# Altium project RadioTransceiverBoard.PrjPcb (part 1 of 3)
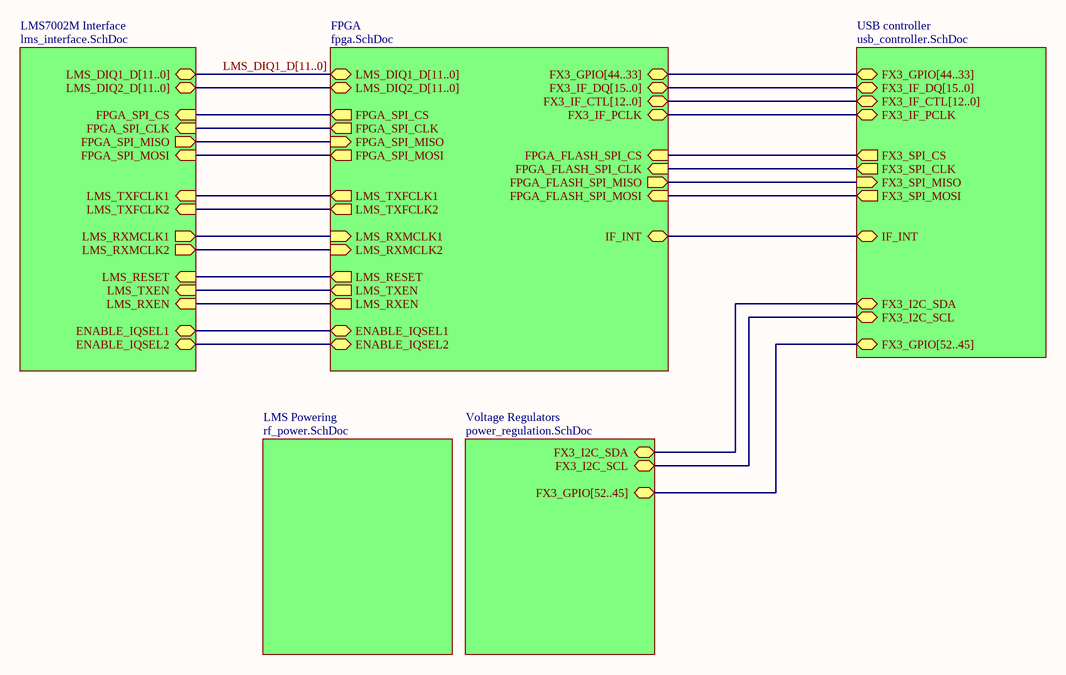
[diagram p0: Radio Transceiver.SchDoc]
17 sheets, 353 parts. Net scope: hierarchical (ports join the sheet entries above them; power ports are global).
Sheets:
  Radio Transceiver.SchDoc
    FPGA = fpga.SchDoc
    LMS7002M Interface = lms_interface.SchDoc
      rf_transmit1 = rf_transmit.SchDoc
      rf_transmit2 = rf_transmit.SchDoc
      rf_receive1 = rf_receive.SchDoc
      rf_receive2 = rf_receive.SchDoc
    USB controller = usb_controller.SchDoc
    Voltage Regulators = power_regulation.SchDoc
    LMS Powering = rf_power.SchDoc
      A_conn_1P25A1 = A_conn_1P25A.SchDoc
      A_conn_1P25A2 = A_conn_1P25A.SchDoc
      A_conn_1P25A3 = A_conn_1P25A.SchDoc
      A_conn_1P25A4 = A_conn_1P25A.SchDoc
      A_conn_1P25A5 = A_conn_1P25A.SchDoc
      A_conn_1P25A6 = A_conn_1P25A.SchDoc
      A_conn_1P25A7 = A_conn_1P25A.SchDoc
      A_conn_1P25A8 = A_conn_1P25A.SchDoc
      A_conn_1P25A9 = A_conn_1P25A.SchDoc
      A_conn_1P25A10 = A_conn_1P25A.SchDoc
      A_conn_1P25A11 = A_conn_1P25A.SchDoc
      A_conn_1P4A1 = A_conn_1P4A.SchDoc
      A_conn_1P4A2 = A_conn_1P4A.SchDoc
      A_conn_1P4A3 = A_conn_1P4A.SchDoc
      A_conn_1P4A4 = A_conn_1P4A.SchDoc
      A_conn_1P4A5 = A_conn_1P4A.SchDoc
      A_conn_1P4A6 = A_conn_1P4A.SchDoc
      B_conn_1P25A1 = B_conn_1P25A.SchDoc
      B_conn_1P25A2 = B_conn_1P25A.SchDoc
      B_conn_1P25A3 = B_conn_1P25A.SchDoc
      A_conn_1P25D1 = A_conn_1P25D.SchDoc
      A_conn_1P25D2 = A_conn_1P25D.SchDoc
      A_conn_1P25D3 = A_conn_1P25D.SchDoc
      A_conn_1P25D4 = A_conn_1P25D.SchDoc
      D_conn_1P25A1 = D_conn_1P25A.SchDoc
      D_conn_1P25A2 = D_conn_1P25A.SchDoc
      A_conn_1P8A1 = A_conn_1P8A.SchDoc
      A_conn_1P8A2 = A_conn_1P8A.SchDoc
      A_conn_1P8A3 = A_conn_1P8A.SchDoc
      A_conn_1P8A4 = A_conn_1P8A.SchDoc
      A_conn_1P8A5 = A_conn_1P8A.SchDoc
      A_conn_1P8A6 = A_conn_1P8A.SchDoc
      A_conn_1P8A7 = A_conn_1P8A.SchDoc
      A_conn_1P8A8 = A_conn_1P8A.SchDoc
      A_conn_1P8A9 = A_conn_1P8A.SchDoc
      A_conn_1P8A10 = A_conn_1P8A.SchDoc
      D_conn_1P8A1 = D_conn_1P8A.SchDoc
      D_conn_1P8A2 = D_conn_1P8A.SchDoc
      C_conn_1P25D1 = C_conn_1P25D.SchDoc
      C_conn_1P25D2 = C_conn_1P25D.SchDoc
      C_conn_1P25D3 = C_conn_1P25D.SchDoc
      C_conn_1P25D4 = C_conn_1P25D.SchDoc
      C_conn_1P8D1 = C_conn_1P8D.SchDoc
      C_conn_1P8D2 = C_conn_1P8D.SchDoc
      C_conn_1P8D3 = C_conn_1P8D.SchDoc
      C_conn_1P8D4 = C_conn_1P8D.SchDoc

## Sheet Radio Transceiver.SchDoc
size A; SheetNumber: 1; SheetTotal: 17

### Sub-sheets
FPGA = fpga.SchDoc: LMS_DIQ1_D[11..0] (bidir), LMS_DIQ2_D[11..0] (bidir), FPGA_FLASH_SPI_CS (in), FPGA_FLASH_SPI_CLK (in), FPGA_FLASH_SPI_MISO (out), FPGA_FLASH_SPI_MOSI (in), FPGA_SPI_CS (out), FPGA_SPI_CLK (out), FPGA_SPI_MISO (in), FPGA_SPI_MOSI (out), LMS_TXFCLK1 (out), LMS_TXFCLK2 (out), LMS_RXMCLK1 (in), LMS_RXMCLK2 (in), FX3_GPIO[44..33] (bidir), FX3_IF_DQ[15..0] (bidir), FX3_IF_CTL[12..0] (bidir), FX3_IF_PCLK (bidir), LMS_RESET (out), LMS_TXEN (out), LMS_RXEN (out), ENABLE_IQSEL1 (bidir), ENABLE_IQSEL2 (bidir), IF_INT (bidir)
LMS7002M Interface = lms_interface.SchDoc: LMS_DIQ1_D[11..0] (bidir), FPGA_SPI_CS (in), FPGA_SPI_CLK (in), FPGA_SPI_MISO (out), FPGA_SPI_MOSI (in), LMS_DIQ2_D[11..0] (bidir), LMS_TXFCLK1 (in), LMS_TXFCLK2 (in), LMS_RXMCLK1 (out), LMS_RXMCLK2 (out), LMS_RESET (in), LMS_TXEN (in), LMS_RXEN (in), ENABLE_IQSEL1 (bidir), ENABLE_IQSEL2 (bidir)
LMS Powering = rf_power.SchDoc: no entries
USB controller = usb_controller.SchDoc: FX3_SPI_CS (out), FX3_SPI_CLK (out), FX3_SPI_MISO (in), FX3_SPI_MOSI (out), FX3_GPIO[44..33] (bidir), FX3_IF_DQ[15..0] (bidir), FX3_IF_CTL[12..0] (bidir), FX3_GPIO[52..45] (bidir), FX3_I2C_SCL (bidir), FX3_I2C_SDA (bidir), FX3_IF_PCLK (bidir), IF_INT (bidir)
Voltage Regulators = power_regulation.SchDoc: FX3_GPIO[52..45] (bidir), FX3_I2C_SCL (bidir), FX3_I2C_SDA (bidir)

### Nets
FPGA_SPI_CLK: sheet FPGA/FPGA_SPI_CLK, sheet LMS7002M Interface/FPGA_SPI_CLK
FPGA_SPI_CS: sheet FPGA/FPGA_SPI_CS, sheet LMS7002M Interface/FPGA_SPI_CS
FPGA_SPI_MISO: sheet FPGA/FPGA_SPI_MISO, sheet LMS7002M Interface/FPGA_SPI_MISO
FPGA_SPI_MOSI: sheet FPGA/FPGA_SPI_MOSI, sheet LMS7002M Interface/FPGA_SPI_MOSI
FX3_I2C_SCL: sheet USB controller/FX3_I2C_SCL, sheet Voltage Regulators/FX3_I2C_SCL
FX3_I2C_SDA: sheet USB controller/FX3_I2C_SDA, sheet Voltage Regulators/FX3_I2C_SDA
FX3_IF_PCLK: sheet FPGA/FX3_IF_PCLK, sheet USB controller/FX3_IF_PCLK
FX3_SPI_CLK: sheet FPGA/FPGA_FLASH_SPI_CLK, sheet USB controller/FX3_SPI_CLK
FX3_SPI_CS: sheet FPGA/FPGA_FLASH_SPI_CS, sheet USB controller/FX3_SPI_CS
FX3_SPI_MISO: sheet FPGA/FPGA_FLASH_SPI_MISO, sheet USB controller/FX3_SPI_MISO
FX3_SPI_MOSI: sheet FPGA/FPGA_FLASH_SPI_MOSI, sheet USB controller/FX3_SPI_MOSI
NetIC200#3_D2: sheet FPGA/LMS_RESET, sheet LMS7002M Interface/LMS_RESET
NetIC200#3_D3: sheet FPGA/LMS_TXEN, sheet LMS7002M Interface/LMS_TXEN
NetIC200#3_D4: sheet FPGA/LMS_RXEN, sheet LMS7002M Interface/LMS_RXEN
NetIC200#3_E1: sheet FPGA/ENABLE_IQSEL1, sheet LMS7002M Interface/ENABLE_IQSEL1
NetIC200#3_E2: sheet FPGA/ENABLE_IQSEL2, sheet LMS7002M Interface/ENABLE_IQSEL2
NetIC200#3_G1: sheet FPGA/LMS_RXMCLK2, sheet LMS7002M Interface/LMS_RXMCLK2
NetIC200#3_G4: sheet FPGA/LMS_TXFCLK2, sheet LMS7002M Interface/LMS_TXFCLK2
NetIC200#3_J2: sheet FPGA/LMS_RXMCLK1, sheet LMS7002M Interface/LMS_RXMCLK1
NetIC200#3_J3: sheet FPGA/LMS_TXFCLK1, sheet LMS7002M Interface/LMS_TXFCLK1
NetIC201_P11: sheet FPGA/IF_INT, sheet USB controller/IF_INT

### Buses and harness runs
bus LMS_DIQ1_D[11..0] = sheet FPGA/LMS_DIQ1_D[11..0] = sheet LMS7002M Interface/LMS_DIQ1_D[11..0]
bus sheet FPGA/FX3_GPIO[44..33] = sheet USB controller/FX3_GPIO[44..33]
bus sheet FPGA/FX3_IF_CTL[12..0] = sheet USB controller/FX3_IF_CTL[12..0]
bus sheet FPGA/FX3_IF_DQ[15..0] = sheet USB controller/FX3_IF_DQ[15..0]
bus sheet FPGA/LMS_DIQ2_D[11..0] = sheet LMS7002M Interface/LMS_DIQ2_D[11..0]
bus sheet USB controller/FX3_GPIO[52..45] = sheet Voltage Regulators/FX3_GPIO[52..45]

## Sheet fpga.SchDoc
size 381 x 241 mm; SheetNumber: 13; SheetTotal: 17
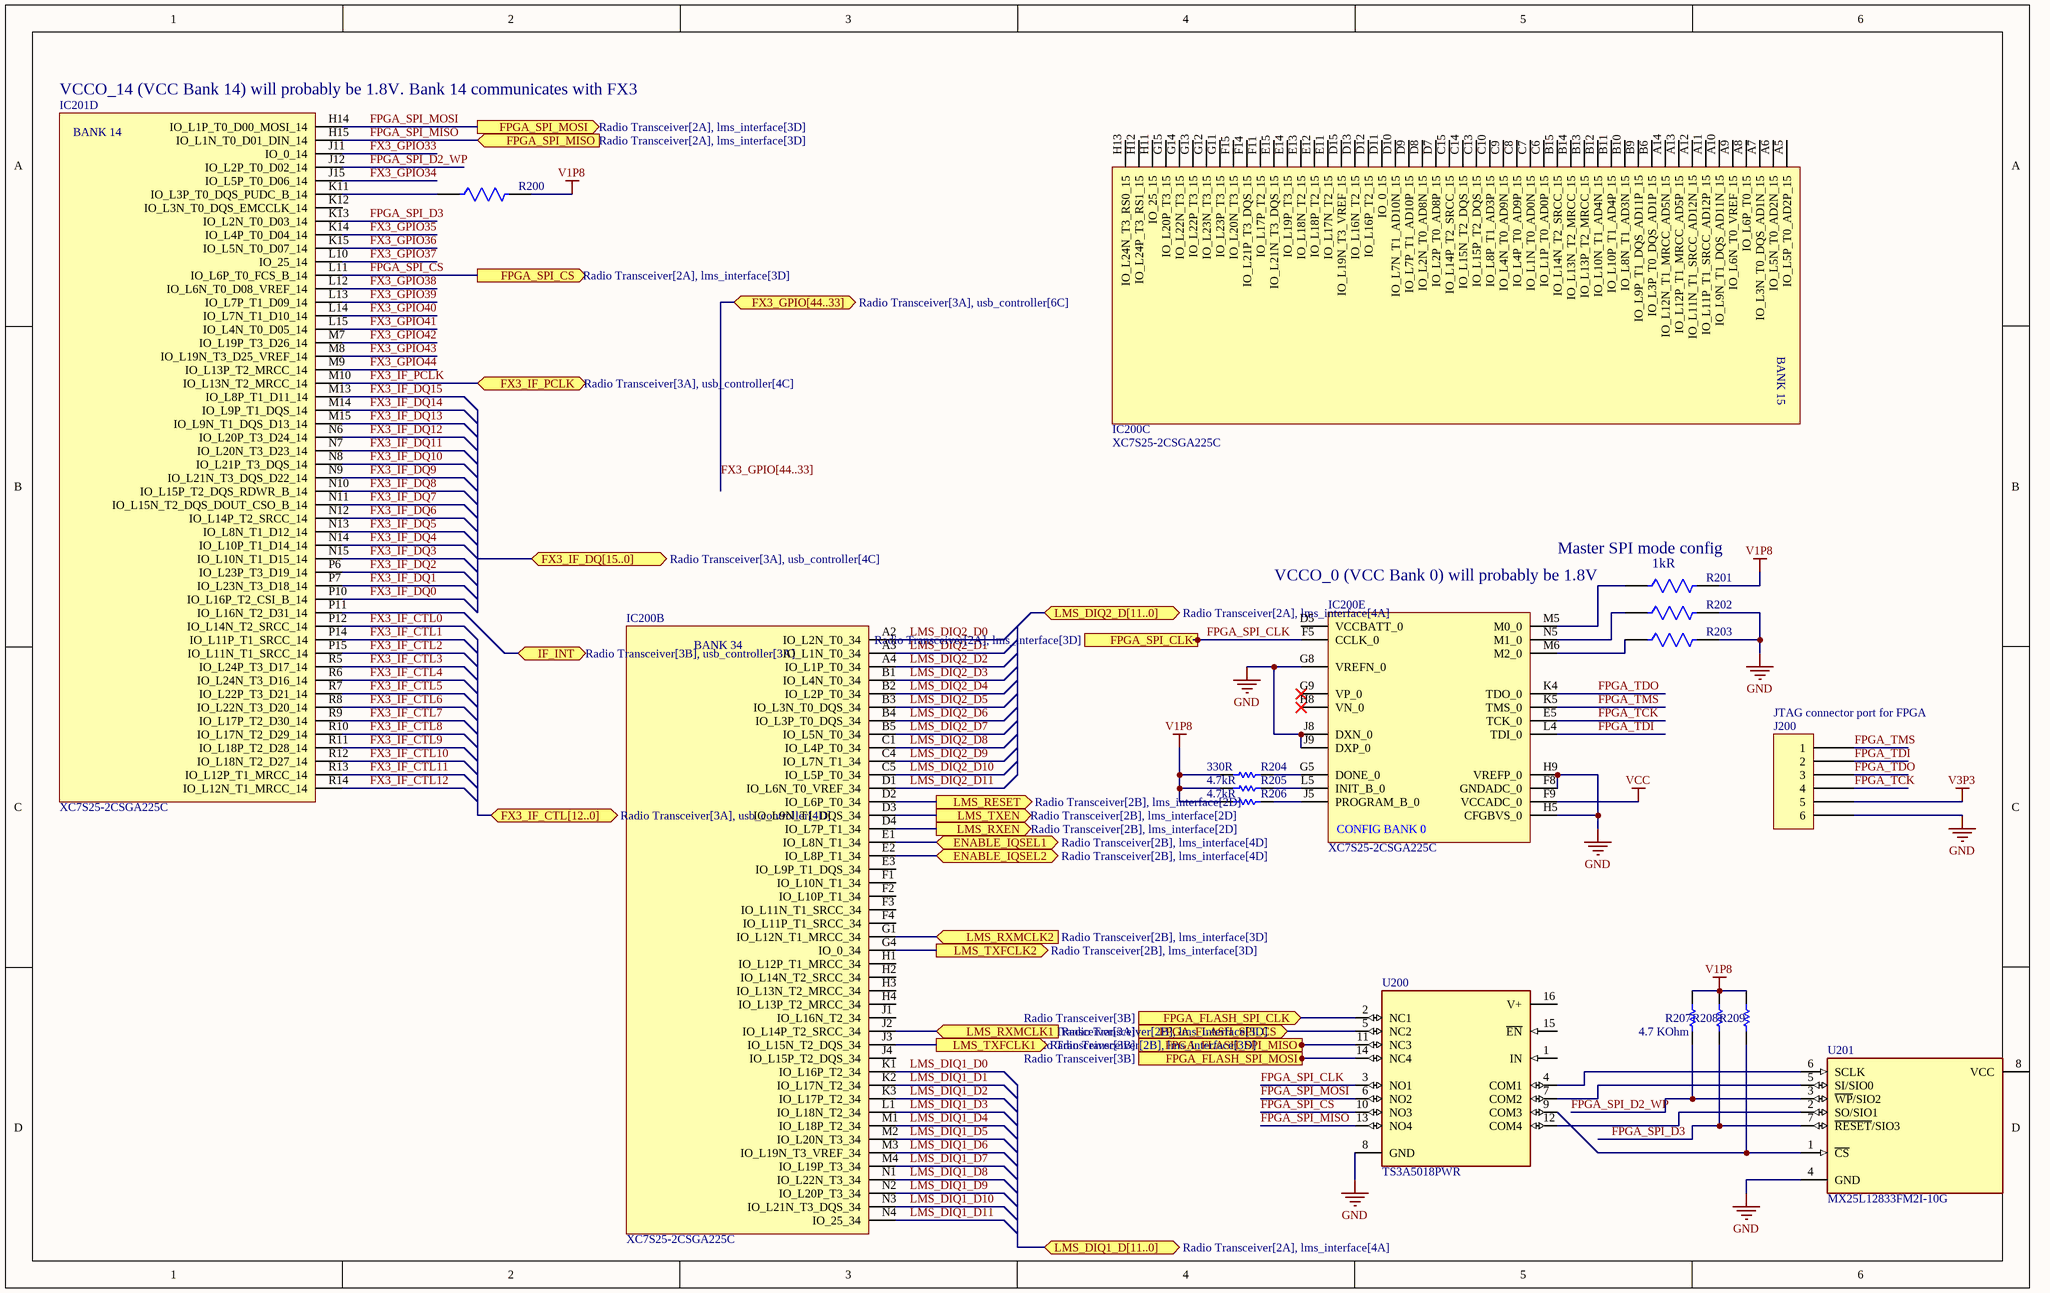
[diagram p1: fpga.SchDoc]

### Parts
(Parts that share a designator on the sheet are numbered #1, #2 ... from top to bottom, then left to right.)
IC200#1  XC7S25-2CSGA225C  [BGA225C80P15X15_1300X1300X140]  (part C of 5)
IC200#2  XC7S25-2CSGA225C  [BGA225C80P15X15_1300X1300X140]  (part E of 6)
IC200#3  XC7S25-2CSGA225C  [BGA225C80P15X15_1300X1300X140]  (part B of 4)
IC201  XC7S25-2CSGA225C  [BGA225C80P15X15_1300X1300X140]  (part D of 5)
J200  JTAG connector port for FPGA  [SULLINS NPPN061BFCN]
R200  AC0603FR-071KL  [FP-AC0603-IPC_B]  (value not drawn)
R201  value 1kR  [FP-AC0603-IPC_B]  (hidden comment: AC0603FR-071KL)
R202  AC0603FR-071KL  [FP-AC0603-IPC_B]  (value not drawn)
R203  AC0603FR-071KL  [FP-AC0603-IPC_B]  (value not drawn)
R204  value 330R  [RESC1005X40X25ML05T05]  (hidden comment: ERJ2RKF3300X)
R205  value 4.7kR  [RESC1005X40X25LL05T05]  (hidden comment: ERJ-2RKF4701X)
R206  value 4.7kR  [RESC1005X40X25LL05T05]  (hidden comment: ERJ-2RKF4701X)
R207  Resistance: 4.7 KOhm  [RESC1005X40X25LL05T05]  (hidden comment: ERJ-2RKF4701X)
R208  ERJ-2RKF4701X  [RESC1005X40X25LL05T05]  (value not drawn)
R209  ERJ-2RKF4701X  [RESC1005X40X25LL05T05]  (value not drawn)
U200  TS3A5018PWR  [FP-PW0016A-IPC_B]
U201  MX25L12833FM2I-10G  [FP-MX25L12833FM2I-10G-MFG]

### Ports
ENABLE_IQSEL1 (bidir, see Radio Transceiver[2B], lms_interface[4D]), ENABLE_IQSEL2 (bidir, see Radio Transceiver[2B], lms_interface[4D]), FPGA_FLASH_SPI_CLK (in, see Radio Transceiver[3B]), FPGA_FLASH_SPI_CS (in, see Radio Transceiver[3A]), FPGA_FLASH_SPI_MISO (out, see Radio Transceiver[3B]), FPGA_FLASH_SPI_MOSI (in, see Radio Transceiver[3B]), FPGA_SPI_CLK (out, see Radio Transceiver[2A], lms_interface[3D]), FPGA_SPI_CS (out, see Radio Transceiver[2A], lms_interface[3D]), FPGA_SPI_MISO (in, see Radio Transceiver[2A], lms_interface[3D]), FPGA_SPI_MOSI (out, see Radio Transceiver[2A], lms_interface[3D]), FX3_GPIO[44..33] (bidir, see Radio Transceiver[3A], usb_controller[6C]), FX3_IF_CTL[12..0] (bidir, see Radio Transceiver[3A], usb_controller[4D]), FX3_IF_DQ[15..0] (bidir, see Radio Transceiver[3A], usb_controller[4C]), FX3_IF_PCLK (bidir, see Radio Transceiver[3A], usb_controller[4C]), IF_INT (bidir, see Radio Transceiver[3B], usb_controller[3A]), LMS_DIQ1_D[11..0] (bidir, see Radio Transceiver[2A], lms_interface[4A]), LMS_DIQ2_D[11..0] (bidir, see Radio Transceiver[2A], lms_interface[4A]), LMS_RESET (out, see Radio Transceiver[2B], lms_interface[2D]), LMS_RXEN (out, see Radio Transceiver[2B], lms_interface[2D]), LMS_RXMCLK1 (in, see Radio Transceiver[2B], lms_interface[3D]), LMS_RXMCLK2 (in, see Radio Transceiver[2B], lms_interface[3D]), LMS_TXEN (out, see Radio Transceiver[2B], lms_interface[2D]), LMS_TXFCLK1 (out, see Radio Transceiver[2B], lms_interface[3D]), LMS_TXFCLK2 (out, see Radio Transceiver[2B], lms_interface[3D])

### Nets
GND: IC200#2.F8(GNDADC_0) IC200#2.G8(VREFN_0) IC200#2.H5(CFGBVS_0) IC200#2.H9(VREFP_0) IC200#2.J8(DXN_0) IC200#2.J9(DXP_0) J200.6 R202.2 R203.2 U200.8(GND) U201.4(GND)
V1P8: R200.2 R201.2 R204.1 R205.1 R206.1 R207.2 R208.2 R209.2
V3P3: J200.5
VCC: IC200#2.F9(VCCADC_0)
FPGA_SPI_CLK: IC200#2.F5(CCLK_0) U200.3(NO1) ; port FPGA_SPI_CLK
FPGA_SPI_CS: IC201.L11(IO_L6P_T0_FCS_B_14) U200.10(NO3) ; port FPGA_SPI_CS
FPGA_SPI_D2_WP: IC201.J12(IO_L2P_T0_D02_14) R207.1 U201.3(~{WP}/SIO2)
FPGA_SPI_D3: IC201.K13(IO_L2N_T0_D03_14) R208.1 U201.7(~{RESET}/SIO3)
FPGA_SPI_MISO: IC201.H15(IO_L1N_T0_D01_DIN_14) U200.13(NO4) ; port FPGA_SPI_MISO
FPGA_SPI_MOSI: IC201.H14(IO_L1P_T0_D00_MOSI_14) U200.6(NO2) ; port FPGA_SPI_MOSI
FPGA_TCK: IC200#2.E5(TCK_0) J200.4
FPGA_TDI: IC200#2.L4(TDI_0) J200.2
FPGA_TDO: IC200#2.K4(TDO_0) J200.3
FPGA_TMS: IC200#2.K5(TMS_0) J200.1
FX3_GPIO33: IC201.J11(IO_0_14)
FX3_GPIO34: IC201.J15(IO_L5P_T0_D06_14)
FX3_GPIO35: IC201.K14(IO_L4P_T0_D04_14)
FX3_GPIO36: IC201.K15(IO_L5N_T0_D07_14)
FX3_GPIO37: IC201.L10(IO_25_14)
FX3_GPIO38: IC201.L12(IO_L6N_T0_D08_VREF_14)
FX3_GPIO39: IC201.L13(IO_L7P_T1_D09_14)
FX3_GPIO40: IC201.L14(IO_L7N_T1_D10_14)
FX3_GPIO41: IC201.L15(IO_L4N_T0_D05_14)
FX3_GPIO42: IC201.M7(IO_L19P_T3_D26_14)
FX3_GPIO43: IC201.M8(IO_L19N_T3_D25_VREF_14)
FX3_GPIO44: IC201.M9(IO_L13P_T2_MRCC_14)
FX3_IF_CTL0: IC201.P12(IO_L14N_T2_SRCC_14)
FX3_IF_CTL1: IC201.P14(IO_L11P_T1_SRCC_14)
FX3_IF_CTL2: IC201.P15(IO_L11N_T1_SRCC_14)
FX3_IF_CTL3: IC201.R5(IO_L24P_T3_D17_14)
FX3_IF_CTL4: IC201.R6(IO_L24N_T3_D16_14)
FX3_IF_CTL5: IC201.R7(IO_L22P_T3_D21_14)
FX3_IF_CTL6: IC201.R8(IO_L22N_T3_D20_14)
FX3_IF_CTL7: IC201.R9(IO_L17P_T2_D30_14)
FX3_IF_CTL8: IC201.R10(IO_L17N_T2_D29_14)
FX3_IF_CTL9: IC201.R11(IO_L18P_T2_D28_14)
FX3_IF_CTL10: IC201.R12(IO_L18N_T2_D27_14)
FX3_IF_CTL11: IC201.R13(IO_L12P_T1_MRCC_14)
FX3_IF_CTL12: IC201.R14(IO_L12N_T1_MRCC_14)
FX3_IF_DQ0: IC201.P10(IO_L16P_T2_CSI_B_14)
FX3_IF_DQ1: IC201.P7(IO_L23N_T3_D18_14)
FX3_IF_DQ2: IC201.P6(IO_L23P_T3_D19_14)
FX3_IF_DQ3: IC201.N15(IO_L10N_T1_D15_14)
FX3_IF_DQ4: IC201.N14(IO_L10P_T1_D14_14)
FX3_IF_DQ5: IC201.N13(IO_L8N_T1_D12_14)
FX3_IF_DQ6: IC201.N12(IO_L14P_T2_SRCC_14)
FX3_IF_DQ7: IC201.N11(IO_L15N_T2_DQS_DOUT_CSO_B_14)
FX3_IF_DQ8: IC201.N10(IO_L15P_T2_DQS_RDWR_B_14)
FX3_IF_DQ9: IC201.N9(IO_L21N_T3_DQS_D22_14)
FX3_IF_DQ10: IC201.N8(IO_L21P_T3_DQS_14)
FX3_IF_DQ11: IC201.N7(IO_L20N_T3_D23_14)
FX3_IF_DQ12: IC201.N6(IO_L20P_T3_D24_14)
FX3_IF_DQ13: IC201.M15(IO_L9N_T1_DQS_D13_14)
FX3_IF_DQ14: IC201.M14(IO_L9P_T1_DQS_14)
FX3_IF_DQ15: IC201.M13(IO_L8P_T1_D11_14)
FX3_IF_PCLK: IC201.M10(IO_L13N_T2_MRCC_14) ; port FX3_IF_PCLK
FX3_SPI_CLK: U200.2(NC1) ; port FPGA_FLASH_SPI_CLK
FX3_SPI_CS: U200.5(NC2) ; port FPGA_FLASH_SPI_CS
FX3_SPI_MISO: U200.11(NC3) ; port FPGA_FLASH_SPI_MISO
FX3_SPI_MOSI: U200.14(NC4) ; port FPGA_FLASH_SPI_MOSI
LMS_DIQ1_D0: IC200#3.K1(IO_L16P_T2_34)
LMS_DIQ1_D1: IC200#3.K2(IO_L17N_T2_34)
LMS_DIQ1_D2: IC200#3.K3(IO_L17P_T2_34)
LMS_DIQ1_D3: IC200#3.L1(IO_L18N_T2_34)
LMS_DIQ1_D4: IC200#3.M1(IO_L18P_T2_34)
LMS_DIQ1_D5: IC200#3.M2(IO_L20N_T3_34)
LMS_DIQ1_D6: IC200#3.M3(IO_L19N_T3_VREF_34)
LMS_DIQ1_D7: IC200#3.M4(IO_L19P_T3_34)
LMS_DIQ1_D8: IC200#3.N1(IO_L22N_T3_34)
LMS_DIQ1_D9: IC200#3.N2(IO_L20P_T3_34)
LMS_DIQ1_D10: IC200#3.N3(IO_L21N_T3_DQS_34)
LMS_DIQ1_D11: IC200#3.N4(IO_25_34)
LMS_DIQ2_D0: IC200#3.A2(IO_L2N_T0_34)
LMS_DIQ2_D1: IC200#3.A3(IO_L1N_T0_34)
LMS_DIQ2_D2: IC200#3.A4(IO_L1P_T0_34)
LMS_DIQ2_D3: IC200#3.B1(IO_L4N_T0_34)
LMS_DIQ2_D4: IC200#3.B2(IO_L2P_T0_34)
LMS_DIQ2_D5: IC200#3.B3(IO_L3N_T0_DQS_34)
LMS_DIQ2_D6: IC200#3.B4(IO_L3P_T0_DQS_34)
LMS_DIQ2_D7: IC200#3.B5(IO_L5N_T0_34)
LMS_DIQ2_D8: IC200#3.C1(IO_L4P_T0_34)
LMS_DIQ2_D9: IC200#3.C4(IO_L7N_T1_34)
LMS_DIQ2_D10: IC200#3.C5(IO_L5P_T0_34)
LMS_DIQ2_D11: IC200#3.D1(IO_L6N_T0_VREF_34)
NetIC200#2_G5: IC200#2.G5(DONE_0) R204.2
NetIC200#2_J5: IC200#2.J5(PROGRAM_B_0) R206.2
NetIC200#2_L5: IC200#2.L5(INIT_B_0) R205.2
NetIC200#2_M5: IC200#2.M5(M0_0) R201.1
NetIC200#2_M6: IC200#2.M6(M2_0) R203.1
NetIC200#2_N5: IC200#2.N5(M1_0) R202.1
NetIC200#3_D2: IC200#3.D2(IO_L6P_T0_34) ; port LMS_RESET
NetIC200#3_D3: IC200#3.D3(IO_L9N_T1_DQS_34) ; port LMS_TXEN
NetIC200#3_D4: IC200#3.D4(IO_L7P_T1_34) ; port LMS_RXEN
NetIC200#3_E1: IC200#3.E1(IO_L8N_T1_34) ; port ENABLE_IQSEL1
NetIC200#3_E2: IC200#3.E2(IO_L8P_T1_34) ; port ENABLE_IQSEL2
NetIC200#3_G1: IC200#3.G1(IO_L12N_T1_MRCC_34) ; port LMS_RXMCLK2
NetIC200#3_G4: IC200#3.G4(IO_0_34) ; port LMS_TXFCLK2
NetIC200#3_J2: IC200#3.J2(IO_L14P_T2_SRCC_34) ; port LMS_RXMCLK1
NetIC200#3_J3: IC200#3.J3(IO_L15N_T2_DQS_34) ; port LMS_TXFCLK1
NetIC201_K11: IC201.K11(IO_L3P_T0_DQS_PUDC_B_14) R200.1
NetIC201_P11: IC201.P11(IO_L16N_T2_D31_14) ; port IF_INT
NetR209_1: R209.1 U200.9(COM3) U201.1(~{CS})
NetU200_4: U200.4(COM1) U201.6(SCLK)
NetU200_7: U200.7(COM2) U201.5(SI/SIO0)
NetU200_12: U200.12(COM4) U201.2(SO/SIO1)

Not connected (* = marked no-connect by the designer): IC200#1 A5(IO_L5P_T0_AD2P_15) A6(IO_L5N_T0_AD2N_15) A7(IO_L3N_T0_DQS_AD1N_15) A8(IO_L6P_T0_15) A9(IO_L6N_T0_VREF_15) A10(IO_L9N_T1_DQS_AD11N_15) A11(IO_L11P_T1_SRCC_AD12P_15) A12(IO_L11N_T1_SRCC_AD12N_15) A13(IO_L12P_T1_MRCC_AD5P_15) A14(IO_L12N_T1_MRCC_AD5N_15) B6(IO_L3P_T0_DQS_AD1P_15) B9(IO_L9P_T1_DQS_AD11P_15) B10(IO_L8N_T1_AD3N_15) B11(IO_L10P_T1_AD4P_15) B12(IO_L10N_T1_AD4N_15) B13(IO_L13P_T2_MRCC_15) B14(IO_L13N_T2_MRCC_15) B15(IO_L14N_T2_SRCC_15) C6(IO_L1P_T0_AD0P_15) C7(IO_L1N_T0_AD0N_15) C8(IO_L4P_T0_AD9P_15) C9(IO_L4N_T0_AD9N_15) C10(IO_L8P_T1_AD3P_15) C13(IO_L15P_T2_DQS_15) C14(IO_L15N_T2_DQS_15) C15(IO_L14P_T2_SRCC_15) D7(IO_L2P_T0_AD8P_15) D8(IO_L2N_T0_AD8N_15) D9(IO_L7P_T1_AD10P_15) D10(IO_L7N_T1_AD10N_15) D11(IO_0_15) D12(IO_L16P_T2_15) D13(IO_L16N_T2_15) D15(IO_L19N_T3_VREF_15) E11(IO_L17N_T2_15) E12(IO_L18P_T2_15) E13(IO_L18N_T2_15) E14(IO_L19P_T3_15) E15(IO_L21N_T3_DQS_15) F11(IO_L17P_T2_15) F14(IO_L21P_T3_DQS_15) F15(IO_L20N_T3_15) G11(IO_L23P_T3_15) G12(IO_L23N_T3_15) G13(IO_L22P_T3_15) G14(IO_L22N_T3_15) G15(IO_L20P_T3_15) H11(IO_25_15) H12(IO_L24P_T3_RS1_15) H13(IO_L24N_T3_RS0_15); IC200#2 D5(VCCBATT_0) G9(VP_0)* H8(VN_0)*; IC200#3 E3(IO_L9P_T1_DQS_34) F1(IO_L10N_T1_34) F2(IO_L10P_T1_34) F3(IO_L11N_T1_SRCC_34) F4(IO_L11P_T1_SRCC_34) H1(IO_L12P_T1_MRCC_34) H2(IO_L14N_T2_SRCC_34) H3(IO_L13N_T2_MRCC_34) H4(IO_L13P_T2_MRCC_34) J1(IO_L16N_T2_34) J4(IO_L15P_T2_DQS_34); IC201 K12(IO_L3N_T0_DQS_EMCCLK_14); U200 1(IN) 15(~{EN}) 16(V+); U201 8(VCC)

### Buses and harness runs
bus FX3_GPIO[44..33] = port FX3_GPIO[44..33]

### Notes on the sheet
- (near IC201) VCCO_14 (VCC Bank 14) will probably be 1.8V. Bank 14 communicates with FX3
- (near R201) Master SPI mode config
- VCCO_0 (VCC Bank 0) will probably be 1.8V
- (in symbol XC7S25-2CSGA225C, part B) BANK 34
- (in symbol XC7S25-2CSGA225C, part C) BANK 15
- (in symbol XC7S25-2CSGA225C, part D) BANK 14
- (in symbol XC7S25-2CSGA225C, part E) CONFIG BANK 0

### Library data of the parts
IC200#1-IC200#3 IC201 = XC7S25-2CSGA225C: Integrated Circuit; Manufacturer_Name: AMD; Datasheet Link: https://www.xilinx.com/support/documentation/data_sheets/ds180_7Series_Overview.pdf; Height: 1.4mm; Manufacturer_Part_Number: XC7S25-2CSGA225C; Mouser Part Number: 217-XC7S25-2CSGA225C; Mouser Price/Stock: https://www.mouser.co.uk/ProductDetail/Xilinx/XC7S25-2CSGA225C?qs=rrS6PyfT74cKBtNHQKB8Jg%3D%3D
J200 = NPPN061BFCN-RC: CONN HDR 6POS 0.079 GOLD PCB; Manufacturer: Sullins Connector Solutions; Connector Type: Header; Contact Length - Post: 0.094" (2.40mm); Current Rating (Amps): 2A; Material Flammability Rating: UL94 V-0; Number of Positions: 6; Number of Positions Loaded: All; Pitch - Mating: 0.079" (2.00mm); Style: Board to Board; Part Number: NPPN061BFCN-RC; ComponentLink1Description: Datasheet; ComponentLink1URL: https://drawings-pdf.s3.amazonaws.com/10483.pdf; ComponentLink2Description: DigiKey Link; ComponentLink2URL: https://www.digikey.com/en/products/detail/sullins-connector-solutions/NPPN061BFCN-RC/804808; Contact Finish - Mating: Gold; Contact Finish - Post: Gold; Contact Finish Thickness - Mating: Flash; Contact Type: Female Socket; Fastening Type: Push-Pull; Insulation Color: Black; Insulation Height: 0.173" (4.40mm); LastUpdated: 6/21/2022 2:43:22 PM; Lifecycle Status: Active; Minimum Order: 1; Mounting Type: Through Hole; Number of Rows: 1; Operating Temperature: -40°C ~ 105°C; Packaging: Tube; Part Status: Active; Price: 0.40; Series: -; Supplier 1: DigiKey; Supplier Part Number 1: S5751-06-ND; Termination: Solder
R200 R202 R203 = CMP-2000-04828-3: RES 1kΩ 1.00% 0.1W 0603; Voltage Rating: 50V; Power Rating: 100mW; Tolerance: 1%; Temperature Coefficient: 100ppm/°C; Resistance: 1kR; Depth: 0.8mm; Case/Package: 0603; Size Code: 0603; Case Code (Metric): 1608; Height: 0.022inch; Series: AC; Width: 0.031inch; Construction: Rectangular; Length: 0.063inch; Case Code (Imperial): 0603; Package Quantity: 1; RoHS Compliant: Yes; Features: Moisture Resistant; Resistor Type: Thick Film; Max Power Dissipation: 100mW; Packaging: Tape and Reel; Termination: SMD/SMT; Ratings: AEC-Q200; Max Operating Temperature: 155°C; Min Operating Temperature: -55°C; Military Standard: Not; Lead Free: Lead Free; Number of Terminations: 2
R201 = CMP-2000-04828-3: RES 1kΩ 1.00% 0.1W 0603; Voltage Rating: 50V; Power Rating: 100mW; Tolerance: 1%; Temperature Coefficient: 100ppm/°C; Depth: 0.8mm; Case/Package: 0603; Size Code: 0603; Case Code (Metric): 1608; Height: 0.022inch; Series: AC; Width: 0.031inch; Construction: Rectangular; Length: 0.063inch; Case Code (Imperial): 0603; Package Quantity: 1; RoHS Compliant: Yes; Features: Moisture Resistant; Resistor Type: Thick Film; Max Power Dissipation: 100mW; Packaging: Tape and Reel; Termination: SMD/SMT; Ratings: AEC-Q200; Max Operating Temperature: 155°C; Min Operating Temperature: -55°C; Military Standard: Not; Resistance: 1kR; Lead Free: Lead Free; Number of Terminations: 2
R204 = CMP-2002-01143-1: Manufacturer: Panasonic; Part Number: ERJ2RKF3300X
R205-R209 = CMP-2002-01154-4: Chip Resistor, 4.7 KOhm, +/- 1%, 0.1 W, -55 to 155 degC, 0402 (1005 Metric), RoHS, Tape and Reel; Voltage Rating: 50 V; Case\/Package: 0402; Power Rating: 100 mW; Height: 0.35 mm; Mounting Technology: Surface Mount; REACH SVHC: Yes; Max Operating Temperature: 155 degC; ComponentLink1Description: Manufacturer URL; ComponentLink2Description: Datasheet; Pins: 2; PackageReference: 0402; Tolerance: 1%; Case Code (Imperial): 0402; Length: 1 mm; PackageDescription: 2-Pin Surface Mount Device, Body 1 x 0.5 mm; PartNumber: ERJ-2RKF4701X; RoHSCompliant: true; Package Quantity: 1; Radiation Hardening: No; DatasheetVersion: 04/2015; Width: 0.5 mm; Case Code (Metric): 1005; Mount: Surface Mount; ComponentLink1URL: http://www.panasonic.com/; Min Operating Temperature: -55 degC; Packaging: Cut Tape; ComponentLink2URL: http://industrial.panasonic.com/cdbs/www-data/pdf/RDA0000/AOA0000C86.pdf
  R205 R206 R208 R209: Resistance: 4.7 KOhm
U200 = CMP-04892-000072-1: IC SWITCH QUAD SPDT 16TSSOP; Number of Outputs: 8; Bandwidth: 300MHz; Number of Bits: 4; Min Supply Voltage: 2.3V; Operating Supply Voltage: 3V; On-State Resistance: 10R; Max Supply Current: 7uA; Polarity: Non-Inverting; Low Level Output Current: 64mA; Nominal Supply Current: 2.5uA; Turn-Off Delay Time: 6.5ns; Turn-On Delay Time: 8ns; Supply Type: Single; Max Supply Voltage: 3.6V; Min Operating Temperature: -40°C; Weight: 0.002183oz; Radiation Hardening: No; REACH SVHC: No SVHC; Case/Package: TSSOP; Max Operating Temperature: 85°C; Packaging: Tape and Reel; Number of Inputs: 4; Contact Plating: Gold; Mount: Surface Mount; Number of Channels: 4; Package Quantity: 1; RoHS Compliant: Yes; Throw Configuration: SPDT; High Level Output Current: 64mA; Number of Pins: 16; Lead Free: Lead Free; Operating Supply Current: 2.5uA
U201 = CMP-105207-000006-1: IC FLASH 128MBIT SPI/QUAD 8SOP; RoHS Compliant: Yes

## Sheet lms_interface.SchDoc
size 381 x 241 mm; SheetNumber: 14; SheetTotal: 17
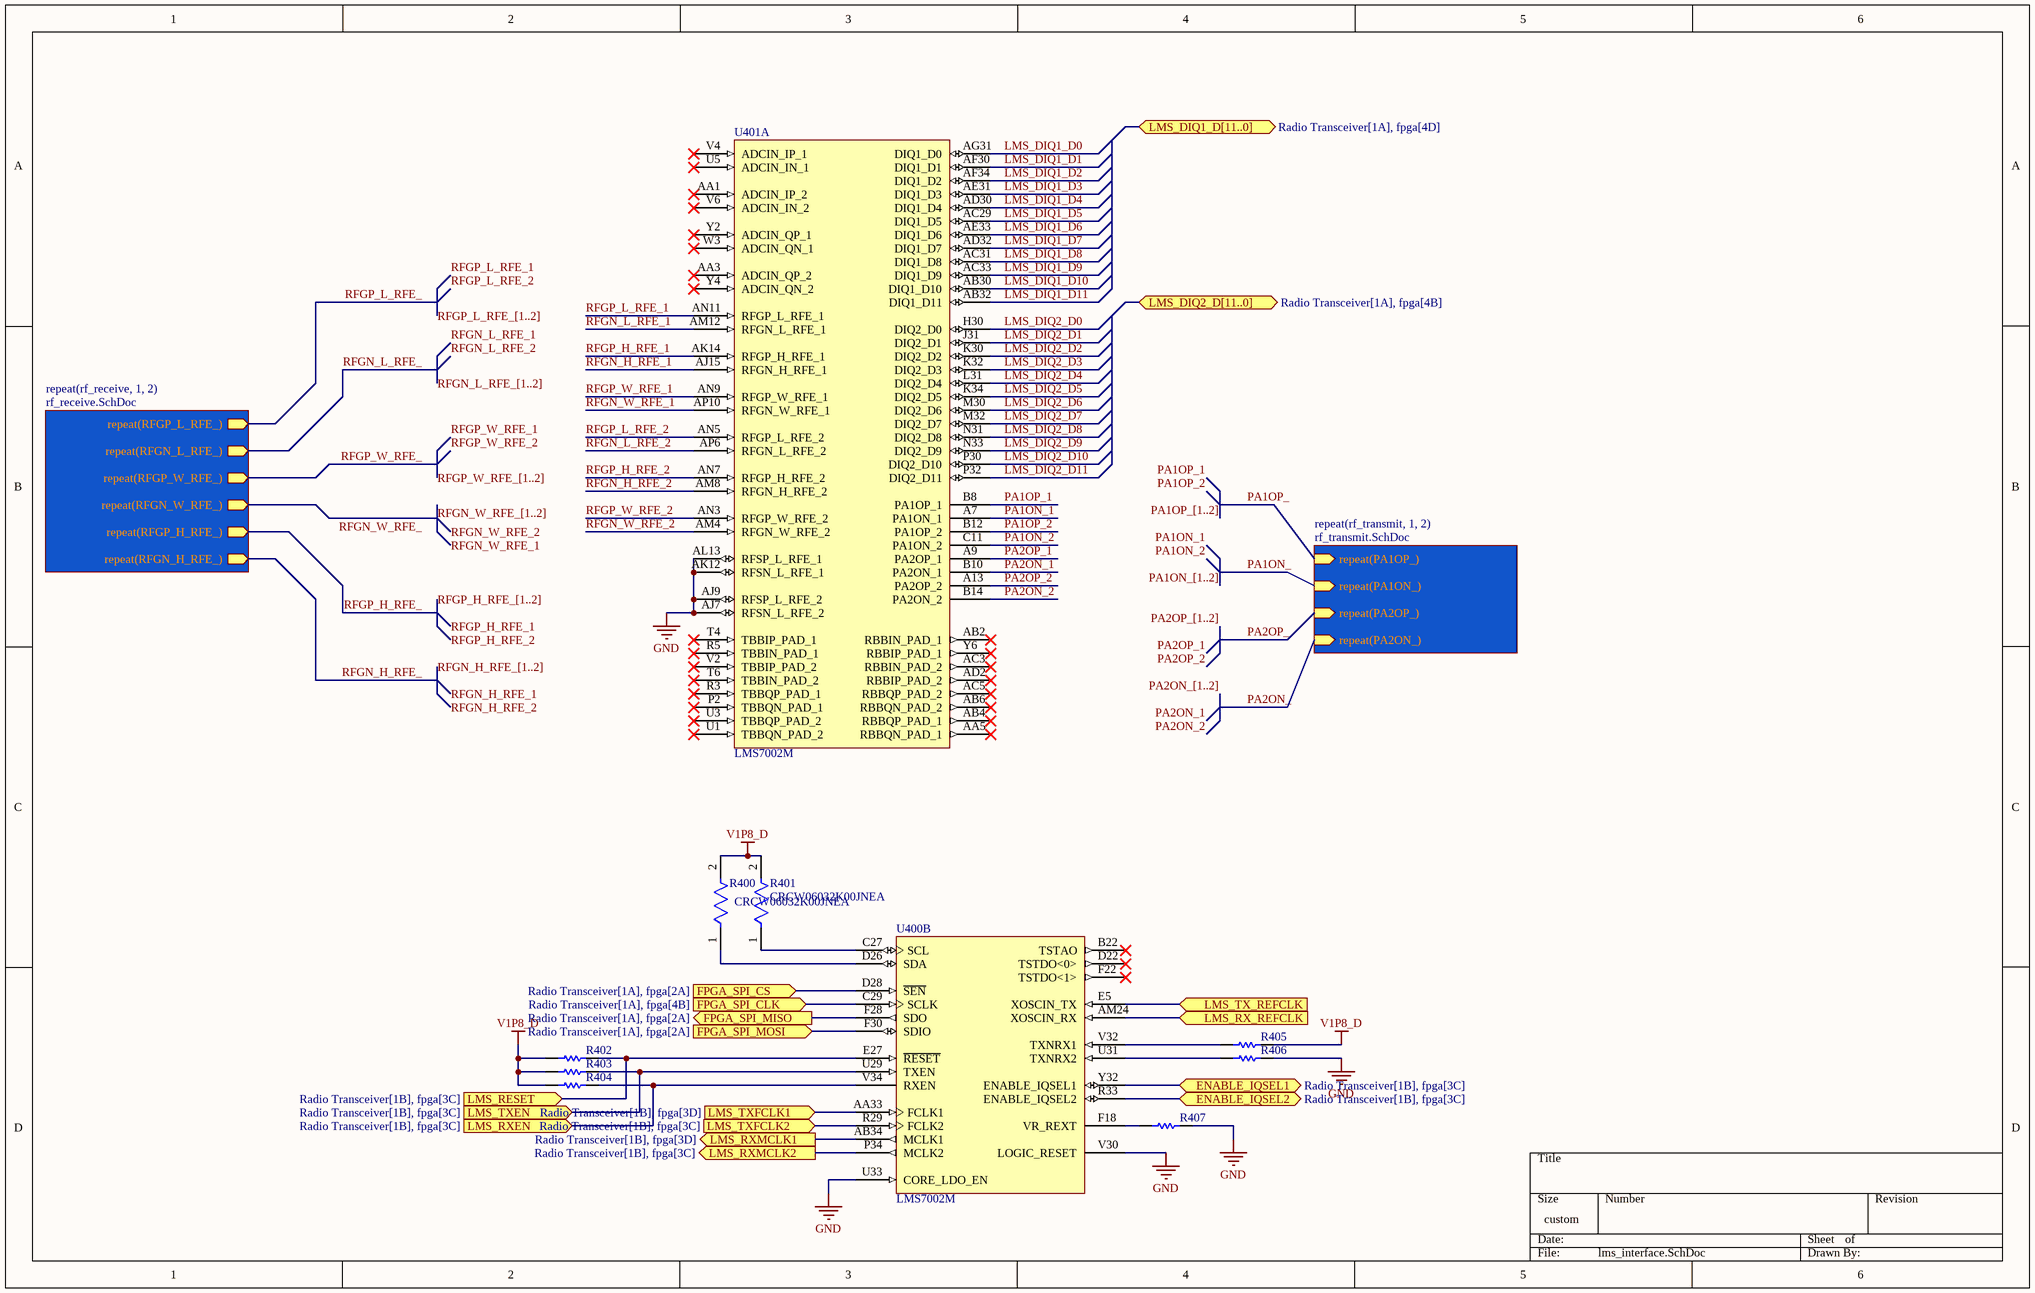
[diagram p2: lms_interface.SchDoc]

### Parts
R400  CRCW06032K00JNEA  [FP-CRCW0603-e3-MFG]
R401  CRCW06032K00JNEA  [FP-CRCW0603-e3-MFG]
R402  ERJ-2GEJ103X  [RESC1005X40X25ML05T05]  (value not drawn)
R403  ERJ-2GEJ103X  [RESC1005X40X25ML05T05]  (value not drawn)
R404  ERJ-2GEJ103X  [RESC1005X40X25ML05T05]  (value not drawn)
R405  ERJ-2GEJ103X  [RESC1005X40X25ML05T05]  (value not drawn)
R406  ERJ-2GEJ103X  [RESC1005X40X25ML05T05]  (value not drawn)
R407  ERJ-2GEJ103X  [RESC1005X40X25ML05T05]  (value not drawn)
U400  LMS7002M  [LM-QFN-261_V]  (part B of 4)
U401  LMS7002M  [LM-QFN-261_V]  (part A of 4)

### Sub-sheets
repeat(rf_receive, 1, 2) = rf_receive.SchDoc: repeat(RFGP_L_RFE_) (out), repeat(RFGP_W_RFE_) (out), repeat(RFGP_H_RFE_) (out), repeat(RFGN_L_RFE_) (out), repeat(RFGN_H_RFE_) (out), repeat(RFGN_W_RFE_) (out)
repeat(rf_transmit, 1, 2) = rf_transmit.SchDoc: repeat(PA1OP_), repeat(PA1ON_), repeat(PA2OP_), repeat(PA2ON_)

### Ports
ENABLE_IQSEL1 (bidir, see Radio Transceiver[1B], fpga[3C]), ENABLE_IQSEL2 (bidir, see Radio Transceiver[1B], fpga[3C]), FPGA_SPI_CLK (in, see Radio Transceiver[1A], fpga[4B]), FPGA_SPI_CS (in, see Radio Transceiver[1A], fpga[2A]), FPGA_SPI_MISO (out, see Radio Transceiver[1A], fpga[2A]), FPGA_SPI_MOSI (in, see Radio Transceiver[1A], fpga[2A]), LMS_DIQ1_D[11..0] (bidir, see Radio Transceiver[1A], fpga[4D]), LMS_DIQ2_D[11..0] (bidir, see Radio Transceiver[1A], fpga[4B]), LMS_RESET (in, see Radio Transceiver[1B], fpga[3C]), LMS_RX_REFCLK (in), LMS_RXEN (in, see Radio Transceiver[1B], fpga[3C]), LMS_RXMCLK1 (out, see Radio Transceiver[1B], fpga[3D]), LMS_RXMCLK2 (out, see Radio Transceiver[1B], fpga[3C]), LMS_TX_REFCLK (in), LMS_TXEN (in, see Radio Transceiver[1B], fpga[3C]), LMS_TXFCLK1 (in, see Radio Transceiver[1B], fpga[3D]), LMS_TXFCLK2 (in, see Radio Transceiver[1B], fpga[3C])

### Nets
GND: R406.2 R407.2 U400.U33(CORE_LDO_EN) U400.V30(LOGIC_RESET) U401.AJ7(RFSN_L_RFE_2) U401.AJ9(RFSP_L_RFE_2) U401.AK12(RFSN_L_RFE_1) U401.AL13(RFSP_L_RFE_1)
V1P8_D: R400.2 R401.2 R402.1 R403.1 R404.1 R405.2  [project net Vin_C_1P8D]
FPGA_SPI_CLK: U400.C29(SCLK) ; port FPGA_SPI_CLK
FPGA_SPI_CS: U400.D28(~{SEN}) ; port FPGA_SPI_CS
FPGA_SPI_MISO: U400.F28(SDO) ; port FPGA_SPI_MISO
FPGA_SPI_MOSI: U400.F30(SDIO) ; port FPGA_SPI_MOSI
LMS_DIQ1_D0: U401.AG31(DIQ1_D0)
LMS_DIQ1_D1: U401.AF30(DIQ1_D1)
LMS_DIQ1_D2: U401.AF34(DIQ1_D2)
LMS_DIQ1_D3: U401.AE31(DIQ1_D3)
LMS_DIQ1_D4: U401.AD30(DIQ1_D4)
LMS_DIQ1_D5: U401.AC29(DIQ1_D5)
LMS_DIQ1_D6: U401.AE33(DIQ1_D6)
LMS_DIQ1_D7: U401.AD32(DIQ1_D7)
LMS_DIQ1_D8: U401.AC31(DIQ1_D8)
LMS_DIQ1_D9: U401.AC33(DIQ1_D9)
LMS_DIQ1_D10: U401.AB30(DIQ1_D10)
LMS_DIQ1_D11: U401.AB32(DIQ1_D11)
LMS_DIQ2_D0: U401.H30(DIQ2_D0)
LMS_DIQ2_D1: U401.J31(DIQ2_D1)
LMS_DIQ2_D2: U401.K30(DIQ2_D2)
LMS_DIQ2_D3: U401.K32(DIQ2_D3)
LMS_DIQ2_D4: U401.L31(DIQ2_D4)
LMS_DIQ2_D5: U401.K34(DIQ2_D5)
LMS_DIQ2_D6: U401.M30(DIQ2_D6)
LMS_DIQ2_D7: U401.M32(DIQ2_D7)
LMS_DIQ2_D8: U401.N31(DIQ2_D8)
LMS_DIQ2_D9: U401.N33(DIQ2_D9)
LMS_DIQ2_D10: U401.P30(DIQ2_D10)
LMS_DIQ2_D11: U401.P32(DIQ2_D11)
PA1ON_: sheet repeat(rf_transmit, 1, 2)/repeat(PA1ON_)
PA1ON_1: U401.A7(PA1ON_1)  [project net PA1ON_]
PA1ON_2: U401.C11(PA1ON_2)  [project net PA1ON_]
PA1OP_: sheet repeat(rf_transmit, 1, 2)/repeat(PA1OP_)
PA1OP_1: U401.B8(PA1OP_1)  [project net PA1OP_]
PA1OP_2: U401.B12(PA1OP_2)  [project net PA1OP_]
PA2ON_: sheet repeat(rf_transmit, 1, 2)/repeat(PA2ON_)
PA2ON_1: U401.B10(PA2ON_1)  [project net PA2ON_]
PA2ON_2: U401.B14(PA2ON_2)  [project net PA2ON_]
PA2OP_: sheet repeat(rf_transmit, 1, 2)/repeat(PA2OP_)
PA2OP_1: U401.A9(PA2OP_1)  [project net PA2OP_]
PA2OP_2: U401.A13(PA2OP_2)  [project net PA2OP_]
RFGN_H_RFE_: sheet repeat(rf_receive, 1, 2)/repeat(RFGN_H_RFE_)
RFGN_H_RFE_1: U401.AJ15(RFGN_H_RFE_1)
RFGN_H_RFE_2: U401.AM8(RFGN_H_RFE_2)
RFGN_L_RFE_: sheet repeat(rf_receive, 1, 2)/repeat(RFGN_L_RFE_)
RFGN_L_RFE_1: U401.AM12(RFGN_L_RFE_1)
RFGN_L_RFE_2: U401.AP6(RFGN_L_RFE_2)
RFGN_W_RFE_: sheet repeat(rf_receive, 1, 2)/repeat(RFGN_W_RFE_)
RFGN_W_RFE_1: U401.AP10(RFGN_W_RFE_1)
RFGN_W_RFE_2: U401.AM4(RFGN_W_RFE_2)
RFGP_H_RFE_: sheet repeat(rf_receive, 1, 2)/repeat(RFGP_H_RFE_)
RFGP_H_RFE_1: U401.AK14(RFGP_H_RFE_1)
RFGP_H_RFE_2: U401.AN7(RFGP_H_RFE_2)
RFGP_L_RFE_: sheet repeat(rf_receive, 1, 2)/repeat(RFGP_L_RFE_)
RFGP_L_RFE_1: U401.AN11(RFGP_L_RFE_1)
RFGP_L_RFE_2: U401.AN5(RFGP_L_RFE_2)
RFGP_W_RFE_: sheet repeat(rf_receive, 1, 2)/repeat(RFGP_W_RFE_)
RFGP_W_RFE_1: U401.AN9(RFGP_W_RFE_1)
RFGP_W_RFE_2: U401.AN3(RFGP_W_RFE_2)
NetIC200#3_D2: R402.2 U400.E27(~{RESET}) ; port LMS_RESET
NetIC200#3_D3: R403.2 U400.U29(TXEN) ; port LMS_TXEN
NetIC200#3_D4: R404.2 U400.V34(RXEN) ; port LMS_RXEN
NetIC200#3_E1: U400.Y32(ENABLE_IQSEL1) ; port ENABLE_IQSEL1
NetIC200#3_E2: U400.R33(ENABLE_IQSEL2) ; port ENABLE_IQSEL2
NetIC200#3_G1: U400.P34(MCLK2) ; port LMS_RXMCLK2
NetIC200#3_G4: U400.R29(FCLK2) ; port LMS_TXFCLK2
NetIC200#3_J2: U400.AB34(MCLK1) ; port LMS_RXMCLK1
NetIC200#3_J3: U400.AA33(FCLK1) ; port LMS_TXFCLK1
NetR400_1: R400.1 U400.D26(SDA)
NetR401_1: R401.1 U400.C27(SCL)
NetR405_1: R405.1 U400.V32(TXNRX1)
NetR406_1: R406.1 U400.U31(TXNRX2)
NetR407_1: R407.1 U400.F18(VR_REXT)
NetU400_AM24: U400.AM24(XOSCIN_RX) ; port LMS_RX_REFCLK
NetU400_E5: U400.E5(XOSCIN_TX) ; port LMS_TX_REFCLK

Not connected (* = marked no-connect by the designer): U400 B22(TSTAO)* D22(TSTDO<0>)* F22(TSTDO<1>)*; U401 AA1(ADCIN_IP_2)* AA3(ADCIN_QP_2)* AA5(RBBQN_PAD_1)* AB2(RBBIN_PAD_1)* AB4(RBBQP_PAD_1)* AB6(RBBQN_PAD_2)* AC3(RBBIN_PAD_2)* AC5(RBBQP_PAD_2)* AD2(RBBIP_PAD_2)* P2(TBBQN_PAD_1)* R3(TBBQP_PAD_1)* R5(TBBIN_PAD_1)* T4(TBBIP_PAD_1)* T6(TBBIN_PAD_2)* U1(TBBQN_PAD_2)* U3(TBBQP_PAD_2)* U5(ADCIN_IN_1)* V2(TBBIP_PAD_2)* V4(ADCIN_IP_1)* V6(ADCIN_IN_2)* W3(ADCIN_QN_1)* Y2(ADCIN_QP_1)* Y4(ADCIN_QN_2)* Y6(RBBIP_PAD_1)*

### Buses and harness runs
bus PA1ON_[1..2]
bus PA1OP_[1..2]
bus PA2ON_[1..2]
bus PA2OP_[1..2]
bus RFGN_H_RFE_[1..2]
bus RFGN_L_RFE_[1..2]
bus RFGN_W_RFE_[1..2]
bus RFGP_H_RFE_[1..2]
bus RFGP_L_RFE_[1..2]
bus RFGP_W_RFE_[1..2]

### Notes on the sheet
- Labels drawn without touching a wire or pin: PA1ON_1, PA1ON_2, PA1OP_1, PA1OP_2, PA2ON_1, PA2ON_2, PA2OP_1, PA2OP_2, RFGN_H_RFE_1, RFGN_H_RFE_2, RFGN_L_RFE_1, RFGN_L_RFE_2, RFGN_W_RFE_1, RFGN_W_RFE_2, RFGP_H_RFE_1, RFGP_H_RFE_2, RFGP_L_RFE_1, RFGP_L_RFE_2, RFGP_W_RFE_1, RFGP_W_RFE_2

### Library data of the parts
R400 R401 = CMP-2000-03163-2: RES Thick Film, 2kΩ, 5%, 0.1W, 200ppm/°C, 0603; Power Rating: 100mW; Working Voltage: 75V; Resistance: 2kR; Min Operating Temperature: -55°C; Package Quantity: 1; Contact Plating: Tin; Number of Terminations: 2; Depth: 0.85mm; Radiation Hardening: No; Weight: 7.1E-05oz; Case Code (Imperial): 0603; Tolerance: 5%; Length: 1.55mm; Temperature Coefficient: 200ppm/°C; Width: 0.033inch; Mount: Surface Mount; Case Code (Metric): 1608; Voltage Rating: 75V; Height: 0.45mm; Case/Package: 0603; Military Standard: Not; Features: Automotive AEC-Q200; Number of Pins: 2; Lead Free: Lead Free; Composition: Thick Film; Packaging: Tape and Reel; Max Operating Temperature: 155°C; Voltage Rating (DC): 75V; Max Power Dissipation: 100mW; Termination: SMD/SMT
R402-R407 = CMP-2002-00433-1: Manufacturer: Panasonic; Part Number: ERJ-2GEJ103X
U400 U401 = CMP-2000-06561-1: FPRF MIMO Transceiver IC with Integrated Microcontroller, 1.1 to 1.89 V, -40 to 85 degC, 261-Pin QFN, RoHS; Manufacturer: LimeMicrosystemsLtd; Current - Receiving: 420mA; Protocol: CDMA,GSM,HSPA,LTE,TD-SCDMA,WCDMA; Frequency: 100kHz~3.8GHz; Current - Transmitting: 350mA; Memory Size: 10kBSRAM; Power - Output: 0dBm; Serial Interfaces: SPI; RF Family/Standard: Cellular; Voltage - Supply: 1.1V~1.89V; GPIO: -; Data Rate (Max): -; Family: RFTransceiverICs; Modulation: -; Mounting Technology: SurfaceMount; Datasheet URL: http://www.richardsonrfpd.com/resources/RellDocuments/SYS_31/LMS7002M.pdf; Package Description: 261-Pin Quad Flat No-lead Package, Body 11.5 x 11.5 mm, Pitch 0.666 mm; Series: -; Sensitivity: -; Category: RF/IFandRFID; Package Reference: QFN-261; Package / Case: 261-SMDModule; Package URL: http://cdn.limemicro.com/wp-content/uploads/2015/08/LMS7002M-PCB-Layout-Recommendations-1.0r5.pdf; Operating Temperature: -40°C~85°C; Manufacturer URL: http://www.limemicro.com/; Packaging: Tray; Datasheet Version: Rev. 2.8.0, 09/2015; Type: TxRx+MCU

## Sheet rf_transmit.SchDoc
size A; SheetNumber: 15; SheetTotal: 17
Used 2 times, as channels LMS7002M Interface/rf_transmit1, LMS7002M Interface/rf_transmit2. Parts and nets are listed once, with the designators drawn on the sheet.
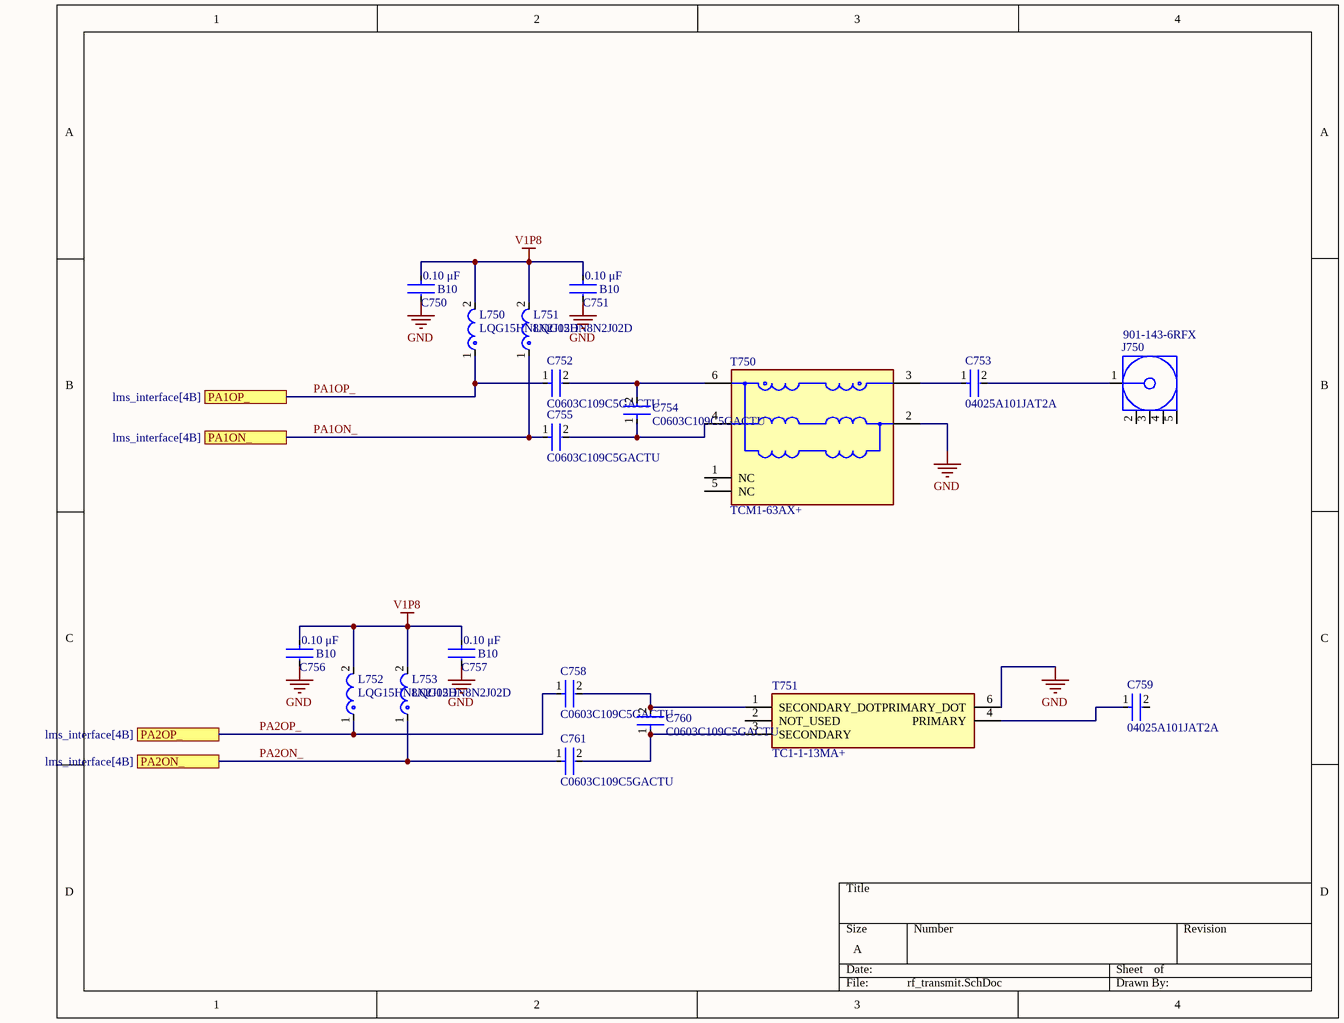
[diagram p3: rf_transmit.SchDoc]

### Parts
C750  B10  Capacitance: 0.10 μF  [FP-C0603C-CF-MFG]
C751  B10  Capacitance: 0.10 μF  [FP-C0603C-CF-MFG]
C752  C0603C109C5GACTU  [FP-C0603C-CF-MFG]
C753  04025A101JAT2A  [FP-0402-L_1_0_1-W_0_5_0_1-MFG]
C754  C0603C109C5GACTU  [FP-C0603C-CF-MFG]
C755  C0603C109C5GACTU  [FP-C0603C-CF-MFG]
C756  B10  Capacitance: 0.10 μF  [FP-C0603C-CF-MFG]
C757  B10  Capacitance: 0.10 μF  [FP-C0603C-CF-MFG]
C758  C0603C109C5GACTU  [FP-C0603C-CF-MFG]
C759  04025A101JAT2A  [FP-0402-L_1_0_1-W_0_5_0_1-MFG]
C760  C0603C109C5GACTU  [FP-C0603C-CF-MFG]
C761  C0603C109C5GACTU  [FP-C0603C-CF-MFG]
J750  901-143-6RFX  [AMPH-901-143-6RFX_V]
L750  LQG15HN8N2J02D  [FP-LQG15HH_02-MFG]
L751  LQG15HN8N2J02D  [FP-LQG15HH_02-MFG]
L752  LQG15HN8N2J02D  [FP-LQG15HH_02-MFG]
L753  LQG15HN8N2J02D  [FP-LQG15HH_02-MFG]
T750  TCM1-63AX+  [FP-TCM1-63AX+-MFG]
T751  TC1-1-13MA+  [TC1113MA]

### Ports
PA1ON_ (see lms_interface[4B]), PA1OP_ (see lms_interface[4B]), PA2ON_ (see lms_interface[4B]), PA2OP_ (see lms_interface[4B])

### Nets
GND: C750.2 C751.2 C756.2 C757.2 T750.2(GND) T751.6(PRIMARY_DOT)
V1P8: C750.1 C751.1 C756.1 C757.1 L750.2 L751.2 L752.2 L753.2
PA1ON_: C755.1 L751.1 ; port PA1ON_
PA1OP_: C752.1 L750.1 ; port PA1OP_
PA2ON_: C761.1 L753.1 ; port PA2ON_
PA2OP_: C758.1 L752.1 ; port PA2OP_
NetC752_2: C752.2 C754.2 T750.6(SECONDARY_DOT)
NetC753_1: C753.1 T750.3(PRIMARY_DOT)
NetC753_2: C753.2 J750.1
NetC754_1: C754.1 C755.2 T750.4(SECONDARY)
NetC758_2: C758.2 C760.2 T751.1(SECONDARY_DOT)
NetC759_1: C759.1 T751.4(PRIMARY)
NetC760_1: C760.1 C761.2 T751.3(SECONDARY)

Not connected (* = marked no-connect by the designer): C759 2; J750 2 3 4 5; T750 1(NC) 5(NC); T751 2(NOT_USED)

### Channels
LMS7002M Interface/rf_transmit1: designators end in _1; ports PA1ON_=PA1ON_ PA1OP_=PA1OP_ PA2ON_=PA2ON_ PA2OP_=PA2OP_
LMS7002M Interface/rf_transmit2: designators end in _2; ports PA1ON_=PA1ON_ PA1OP_=PA1OP_ PA2ON_=PA2ON_ PA2OP_=PA2OP_

### Library data of the parts
C750 C751 C756 C757 = CMP-2006-03061-2: CAP CER 0.1UF 50V X7R 0603; Manufacturer: KEMET; Manufacturer Part Number: C0603C104K5RACTU; Tolerance: 0.1; Temperature Coefficient: 30ppm/°C; Material: Ceramic; Automotive Grade: Grade 1; Value: 0.10 μF; Temperature: -55°C to +125°C; RoHS: TRUE; Temperature Range High: +125°C; Lead Free: Yes; Octopart: https://octopart.com/c0603c104k5ractu-kemet-139244; Digikey Description: CAP CER 0.1UF 50V X7R 0603; Category: Cap; Package: C0603C-CF; ComponentLink2Description: Datasheet; Temperature Range Low: -55°C; Device Class L1: Passive Components; Voltage Rating: 50 V; Automotive: Yes; Device Class L3: Ceramic Capacitors; ComponentLink2URL: https://api.kemet.com/component-edge/download/datasheet/C0603C100J5GACAUTO.pdf; Device Class L2: Capacitors; Temperature Characteristic: X7R; Height: 0.87mm
C752 C754 C755 C758 C760 C761 = CMP-2006-03328-2: CAP CER 1PF 50V C0G/NP0 0603; Manufacturer: KEMET; Value: 1.0 pF; Temperature Characteristic: C0G; Tolerance: 0.25 pF; Temperature Coefficient: 30ppm/°C; Automotive Grade: Grade 1; Material: Ceramic; Device Class L1: Passive Components; Temperature Range High: +125°C; Temperature: -55°C to +125°C; Height: 0.87mm; Digikey Description: CAP CER 1PF 50V C0G/NP0 0603; Voltage Rating: 50 V; ComponentLink2Description: Datasheet; Capacitance: 1.0 pF; Lead Free: Yes; ComponentLink2URL: https://api.kemet.com/component-edge/download/datasheet/C0603C100J5GACAUTO.pdf; Mouser Description: Multilayer Ceramic Capacitors MLCC - SMD/SMT 50volts 1.0pF C0G 0.25%; Temperature Range Low: -55°C; Device Class L3: Ceramic Capacitors; Device Class L2: Capacitors; Automotive: Yes; RoHS: TRUE; Package: C0603C-CF; Category: Cap; Manufacturer Part Number: C0603C109C5GACTU; Octopart: https://octopart.com/c0603c109c5gactu-kemet-107248
C753 C759 = CMP-2008-02568-3: General Purpose Ceramic Capacitor, 0402, 100pF, 5%, C0G, 30ppm/°C, 50V; Insulation Resistance: 1GR; Dissipation Factor: 2.5%; REACH SVHC: No SVHC; Termination: SMD/SMT; Construction: Flat; Voltage: 50V; Contact Plating: Tin; Width: 0.02inch; Series: -; Voltage Rating (DC): 50V; Voltage Rating: 50V; Height: 0.56mm; Tolerance: 5%; Dielectric: C0G; Max Operating Temperature: 125°C; Length: 1mm; Lead Free: Lead Free; Case/Package: 0402; Min Operating Temperature: -55°C; Depth: 0.5mm; Case Code (Metric): 1005; Thickness: 0.022inch; Radiation Hardening: No; Temperature Coefficient: 30ppm/°C; Case Code (Imperial): 0402; Mount: Surface Mount; Capacitance: 100pF; Packaging: Tape and Reel; Package Quantity: 1; RoHS Compliant: Yes
J750 = CMP-2000-05705-1: Coaxial connector, 50 Ohm, -65 to 165 degC, 5-Pin THD, RoHS, Bulk; Manufacturer: Amphenol; Catalog Drawings: 901-143-6RFXMountingHole; 3D Model: 901-143-6RFX.igs; Body Material: Brass; Connector Type: Jack,FemaleSocket; Shield Termination: Solder; Other Names: 901-143-6-RFX9011436RFXARFX1232; Online Catalog: SMA,RFX; Frequency - Max: 18GHz; Body Finish: Gold; Dielectric Material: Polytetrafluoroethylene(PTFE); Center Contact Material: BerylliumCopper; Impedance: 50Ohm; Connector Style: SMA; Mounting Technology: ThroughHole; Mounting Type: ThroughHole,RightAngle; Cable Group: -; Series: -; Package Description: 5-Pin Through Hole Device, Body 7 x 7 mm, Pitch 2.54 mm; Package Reference: 901-143-6RFX; Voltage Rating: -; Standard Package: 1; Fastening Type: Threaded; Housing Color: Gold; Datasheet URL: http://www.amphenolrf.com/downloads/dl/file/id/2712/product/3102/901_143_6rfx_customer_drawing.pdf; Family: CoaxialConnectors(RF); Contact Termination: Solder; Manufacturer URL: http://www.amphenol.com/; Operating Temperature: -65°C~165°C; Category: Connectors,Interconnects; Packaging: Bulk; Features: -; Center Contact Plating: Gold; Datasheet Version: Rev. C, 06/2010; Ingress Protection: -
L750-L753 = CMP-06042-008586-1: Multilayer type RF Inductor 8.2nH ±5% 0.25Ω 500mA 0402; Core Material: Air; Shielding: Unshielded; Current Rating: 300mA; Test Frequency: 100MHz; Self Resonant Frequency: 3.6GHz; Q Factor: 8; DC Resistance (DCR): 330mR; Case/Package: 0402; Max Operating Temperature: 125°C; Military Standard: Not; Depth: 0.55mm; Lead Free: Lead Free; DC Current: 300mA; Length: 1mm; Height: 0.02inch; Width: 0.5mm; Termination: SMD/SMT; Max DC Current: 300mA; Min Operating Temperature: -55°C; Height - Seated (Max): 0.022inch; Radiation Hardening: No; Inductance: 8.2nH; Packaging: Tape and Reel; REACH SVHC: No SVHC; Case Code (Imperial): 0402; Package Quantity: 1; Tolerance: 5%; Case Code (Metric): 1005; Mount: Surface Mount; Inductance Tolerance: 5%
T750 = CMP-199822-000001-1: 1:1 CORE & WIRE Transformer, 10 - 6000 MHz, 50Ω; Manufacturer: Mini-Circuits; Insertion Loss: 1.16-1.8dB; Return Loss: 9.42-16.9dB; Lead Free: Yes; Device Class L3: unset; Temperature: -40°C to +85°C; Manufacturer Part Number: TCM1-63AX+; Frequency: 10-6000MHz; Device Class L2: Transformers; RoHS: TRUE; Octopart: https://octopart.com/tcm1-63ax%2B-mini-circuits-107315723; Temperature Range Low: -40°C; Category: Trans; Package: 0; ComponentLink2URL: https://www.minicircuits.com/pdfs/TCM1-63AX+.pdf; ComponentLink2Description: Datasheet; Automotive: No; Height: 4.06mm; Device Class L1: Passive Components; Temperature Range High: +85°C; Turns Ratio: 1:1
T751 = TC1-1-13MA+: Transformer; Manufacturer_Name: Mini-Circuits; Datasheet Link: https://www.minicircuits.com/pdfs/TC1-1-13MA+.pdf; Height: 4.06mm; Manufacturer_Part_Number: TC1-1-13MA+; Mouser Part Number: 139-TC1-1-13MA; Mouser Price/Stock: https://www.mouser.co.uk/ProductDetail/Mini-Circuits/TC1-1-13MA%2b?qs=xZ%2FP%252Ba9zWqaQyucfPXsKqA%3D%3D

## Sheet rf_receive.SchDoc
size A; SheetNumber: 16; SheetTotal: 17
Used 2 times, as channels LMS7002M Interface/rf_receive1, LMS7002M Interface/rf_receive2. Parts and nets are listed once, with the designators drawn on the sheet.
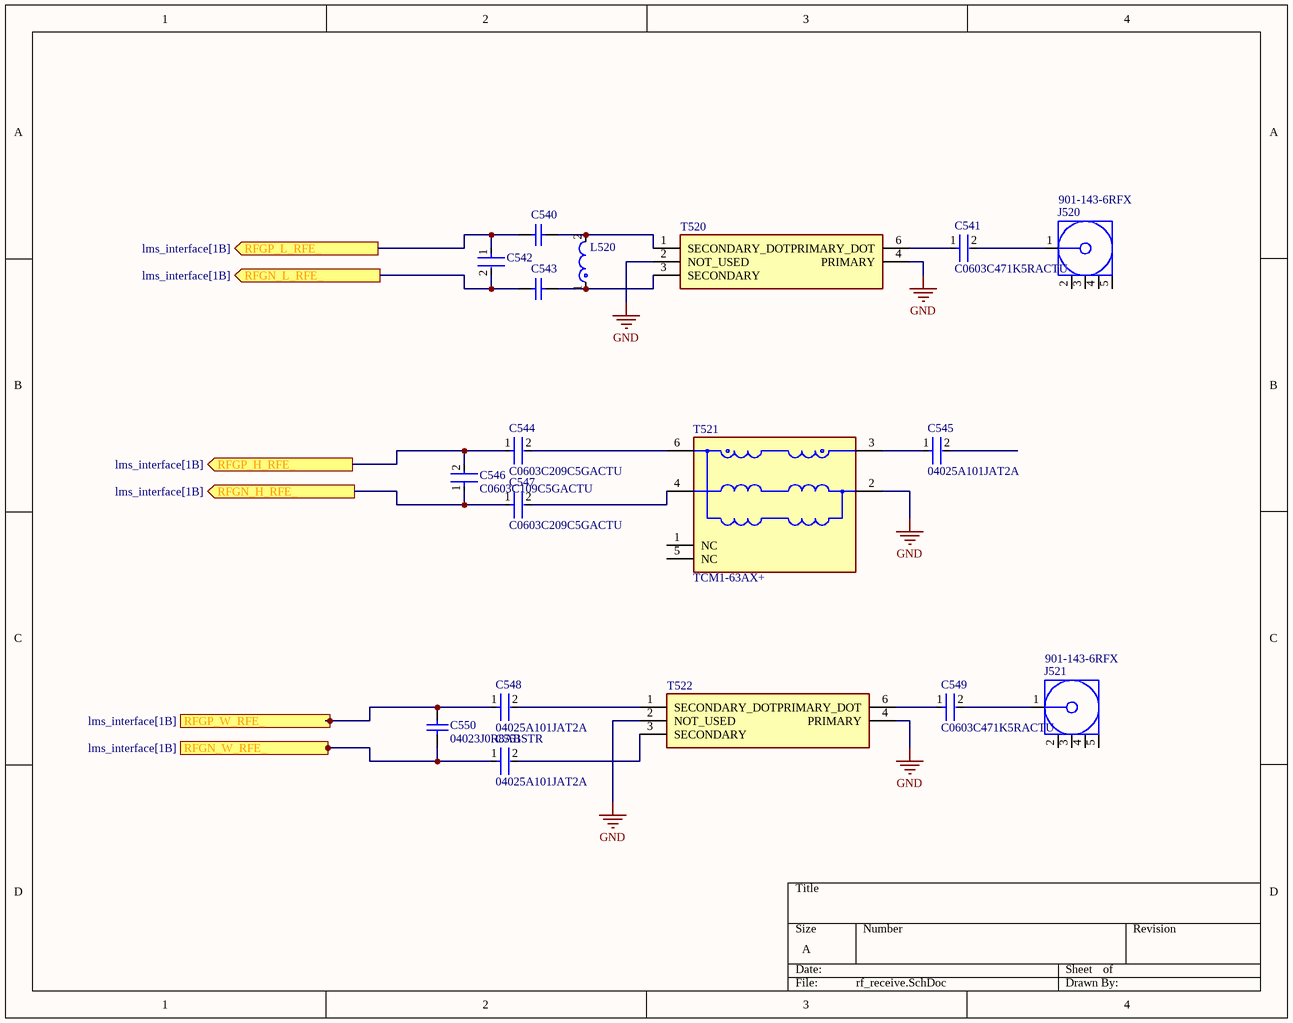
[diagram p4: rf_receive.SchDoc]

### Parts
C540  08055A511JAT2A  [CAPC2013X94X50LL20T25]  (value not drawn)
C541  C0603C471K5RACTU  [FP-C0603C-CF-MFG]
C542  GJM1555C1H1R2BB01D  [FP-GJM155-0_05-IPC_B]  (value not drawn)
C543  08055A511JAT2A  [CAPC2013X94X50LL20T25]  (value not drawn)
C544  C0603C209C5GACTU  [FP-C0603C-CF-MFG]
C545  04025A101JAT2A  [FP-0402-L_1_0_1-W_0_5_0_1-MFG]
C546  C0603C109C5GACTU  [FP-C0603C-CF-MFG]
C547  C0603C209C5GACTU  [FP-C0603C-CF-MFG]
C548  04025A101JAT2A  [FP-0402-L_1_0_1-W_0_5_0_1-MFG]
C549  C0603C471K5RACTU  [FP-C0603C-CF-MFG]
C550  04023J0R8ABSTR  [CAPC1006X50X20NL10T10]
C551  04025A101JAT2A  [FP-0402-L_1_0_1-W_0_5_0_1-MFG]
J520  901-143-6RFX  [AMPH-901-143-6RFX_V]
J521  901-143-6RFX  [AMPH-901-143-6RFX_V]
L520  LQG15HN8N2J02D  [FP-LQG15HH_02-MFG]  (value not drawn)
T520  TC1-1-13MA+  [TC1113MA]  (value not drawn)
T521  TCM1-63AX+  [FP-TCM1-63AX+-MFG]
T522  TC1-1-13MA+  [TC1113MA]  (value not drawn)

### Ports
RFGN_H_RFE_ (out, see lms_interface[1B]), RFGN_L_RFE_ (out, see lms_interface[1B]), RFGN_W_RFE_ (out, see lms_interface[1B]), RFGP_H_RFE_ (out, see lms_interface[1B]), RFGP_L_RFE_ (out, see lms_interface[1B]), RFGP_W_RFE_ (out, see lms_interface[1B])

### Nets
GND: T520.2(NOT_USED) T520.4(PRIMARY) T521.2(GND) T522.2(NOT_USED) T522.4(PRIMARY)
RFGN_H_RFE_: C546.1 C547.1 ; port RFGN_H_RFE_
RFGN_L_RFE_: C542.2 C543.1 ; port RFGN_L_RFE_
RFGN_W_RFE_: C550.1 C551.1 ; port RFGN_W_RFE_
RFGP_H_RFE_: C544.1 C546.2 ; port RFGP_H_RFE_
RFGP_L_RFE_: C540.1 C542.1 ; port RFGP_L_RFE_
RFGP_W_RFE_: C548.1 C550.2 ; port RFGP_W_RFE_
NetC540_2: C540.2 L520.2 T520.1(SECONDARY_DOT)
NetC541_1: C541.1 T520.6(PRIMARY_DOT)
NetC541_2: C541.2 J520.1
NetC543_2: C543.2 L520.1 T520.3(SECONDARY)
NetC544_2: C544.2 T521.6(SECONDARY_DOT)
NetC545_1: C545.1 T521.3(PRIMARY_DOT)
NetC547_2: C547.2 T521.4(SECONDARY)
NetC548_2: C548.2 T522.1(SECONDARY_DOT)
NetC549_1: C549.1 T522.6(PRIMARY_DOT)
NetC549_2: C549.2 J521.1
NetC551_2: C551.2 T522.3(SECONDARY)

Not connected (* = marked no-connect by the designer): C545 2; J520 2 3 4 5; J521 2 3 4 5; T521 1(NC) 5(NC)

### Channels
LMS7002M Interface/rf_receive1: designators end in _1; ports RFGN_H_RFE_=RFGN_H_RFE_1 RFGN_L_RFE_=RFGN_L_RFE_1 RFGN_W_RFE_=RFGN_W_RFE_1 RFGP_H_RFE_=RFGP_H_RFE_1 RFGP_L_RFE_=RFGP_L_RFE_1 RFGP_W_RFE_=RFGP_W_RFE_1
LMS7002M Interface/rf_receive2: designators end in _2; ports RFGN_H_RFE_=RFGN_H_RFE_2 RFGN_L_RFE_=RFGN_L_RFE_2 RFGN_W_RFE_=RFGN_W_RFE_2 RFGP_H_RFE_=RFGP_H_RFE_2 RFGP_L_RFE_=RFGP_L_RFE_2 RFGP_W_RFE_=RFGP_W_RFE_2

### Library data of the parts
C540 C543 = CMP-2007-04331-1: Manufacturer: AVX Interconnect / Elco; Part Number: 08055A511JAT2A
C541 C549 = CMP-2006-03816-2: CAP CER 470PF 50V X7R 0603; Manufacturer: KEMET; Tolerance: 0.1; Temperature Coefficient: 30ppm/°C; Material: Ceramic; Automotive Grade: Grade 1; Description: C0603 470 pF X7R 30ppm/°C 10.00% 50 V; Capacitance: 470 pF; Manufacturer Part Number: C0603C471K5RACTU; Temperature Characteristic: X7R; Mouser Description: Ceramic Capacitor, 470Pf, 50V, X7R, 10%, 0603, Full Reel; Height: 0.87mm; Temperature: -55°C to +125°C; RoHS: TRUE; Lead Free: Yes; Category: Cap; ComponentLink2URL: https://api.kemet.com/component-edge/download/datasheet/C0603C100J5GACAUTO.pdf; Device Class L3: Ceramic Capacitors; Temperature Range High: +125°C; Package: C0603C-CF; Automotive: Yes; Device Class L2: Capacitors; Device Class L1: Passive Components; Value: 470 pF; Digikey Description: CAP CER 470PF 50V X7R 0603; Temperature Range Low: -55°C; ComponentLink2Description: Datasheet; Voltage Rating: 50 V; Octopart: https://octopart.com/c0603c471k5ractu-kemet-89311
C542 = CMP-2008-03813-2: Multi-Layer Ceramic Capacitor 1.2pF C0G  ±0.1pF 0402 Paper T/R; Voltage Rating (DC): 50V; Temperature Coefficient: 30ppm/°C; Case Code (Metric): 1005; Lead Free: Lead Free; Packaging: Tape and Reel; Radiation Hardening: No; Dielectric: C0G; Case Code (Imperial): 0402; Weight: 2.3E-05oz; Width: 0.5mm; Case/Package: 0402; Length: 1mm; Voltage Rating: 50V; Number of Pins: 2; Depth: 0.5mm; Thickness: 0.022inch; Voltage: 50V; Package Quantity: 10000; Max Operating Temperature: 125°C; Height: 0.5mm; REACH SVHC: No SVHC; Capacitance: 1.2pF; Mount: Surface Mount; Min Operating Temperature: -55°C; Termination: SMD/SMT; Lead Pitch: 0.3mm
C544 C547 = CMP-1035-00141-3: CAP CER 2PF 50V C0G/NP0 0603; Manufacturer: KEMET; Tolerance: 0.25 pF; Value: 2.0 pF; Automotive Grade: Grade 1; Description: C0603 2.0 pF C0G 30ppm/°C 0.25 pF 50 V; Temperature Characteristic: C0G; Material: Ceramic; Temperature Coefficient: 30ppm/°C; Lead Free: Yes; Automotive: Yes; Temperature Range Low: -55°C; Capacitance: 2.0 pF; ComponentLink2URL: https://api.kemet.com/component-edge/download/datasheet/C0603C100J5GACAUTO.pdf; Octopart: https://octopart.com/c0603c209c5gactu-kemet-193083; Device Class L3: Ceramic Capacitors; Temperature: -55°C to +125°C; Height: 0.87mm; RoHS: TRUE; ComponentLink2Description: Datasheet; Temperature Range High: +125°C; Package: C0603C-CF; Category: Cap; Manufacturer Part Number: C0603C209C5GACTU; Voltage Rating: 50 V; Device Class L2: Capacitors; Mouser Description: Multilayer Ceramic Capacitors MLCC - SMD/SMT 50volts 2.0pF C0G 0.25%; Digikey Description: CAP CER 2PF 50V C0G/NP0 0603; Device Class L1: Passive Components
C545 C548 C551 = CMP-2008-02568-3: as C753 on sheet rf_transmit; REACH SVHC: No SVHC; Termination: SMD/SMT; Construction: Flat; Voltage: 50V; Contact Plating: Tin; Width: 0.02inch; Series: -; Voltage Rating (DC): 50V; Voltage Rating: 50V; Height: 0.56mm; Tolerance: 5%; Dielectric: C0G; Max Operating Temperature: 125°C; Length: 1mm; Lead Free: Lead Free; Case/Package: 0402; Min Operating Temperature: -55°C; Depth: 0.5mm; Case Code (Metric): 1005; Thickness: 0.022inch; Radiation Hardening: No; Temperature Coefficient: 30ppm/°C; Case Code (Imperial): 0402; Mount: Surface Mount; Capacitance: 100pF; Packaging: Tape and Reel; Package Quantity: 1; RoHS Compliant: Yes
C546 = CMP-2006-03328-2: CAP CER 1PF 50V C0G/NP0 0603; Manufacturer: KEMET; Value: 1.0 pF; Temperature Characteristic: C0G; Tolerance: 0.25 pF; Temperature Coefficient: 30ppm/°C; Description: C0603 1.0 pF C0G 30ppm/°C 0.25 pF 50 V; Automotive Grade: Grade 1; Material: Ceramic; Device Class L1: Passive Components; Temperature Range High: +125°C; Temperature: -55°C to +125°C; Height: 0.87mm; Digikey Description: CAP CER 1PF 50V C0G/NP0 0603; Voltage Rating: 50 V; ComponentLink2Description: Datasheet; Capacitance: 1.0 pF; Lead Free: Yes; ComponentLink2URL: https://api.kemet.com/component-edge/download/datasheet/C0603C100J5GACAUTO.pdf; Mouser Description: Multilayer Ceramic Capacitors MLCC - SMD/SMT 50volts 1.0pF C0G 0.25%; Temperature Range Low: -55°C; Device Class L3: Ceramic Capacitors; Device Class L2: Capacitors; Automotive: Yes; RoHS: TRUE; Package: C0603C-CF; Category: Cap; Manufacturer Part Number: C0603C109C5GACTU; Octopart: https://octopart.com/c0603c109c5gactu-kemet-107248
C550 = CMP-2008-04729-1: Manufacturer: AVX Interconnect / Elco; Part Number: 04023J0R8ABSTR
J520 J521 = CMP-2000-05705-1: as J750 on sheet rf_transmit; Mounting Technology: ThroughHole; Mounting Type: ThroughHole,RightAngle; Cable Group: -; Series: -; Package Description: 5-Pin Through Hole Device, Body 7 x 7 mm, Pitch 2.54 mm; Package Reference: 901-143-6RFX; Voltage Rating: -; Standard Package: 1; Fastening Type: Threaded; Housing Color: Gold; Datasheet URL: http://www.amphenolrf.com/downloads/dl/file/id/2712/product/3102/901_143_6rfx_customer_drawing.pdf; Family: CoaxialConnectors(RF); Contact Termination: Solder; Manufacturer URL: http://www.amphenol.com/; Operating Temperature: -65°C~165°C; Category: Connectors,Interconnects; Packaging: Bulk; Features: -; Center Contact Plating: Gold; Datasheet Version: Rev. C, 06/2010; Ingress Protection: -
L520 = CMP-06042-008586-1: as L750 on sheet rf_transmit; Case/Package: 0402; Max Operating Temperature: 125°C; Military Standard: Not; Depth: 0.55mm; Lead Free: Lead Free; DC Current: 300mA; Length: 1mm; Height: 0.02inch; Width: 0.5mm; Termination: SMD/SMT; Max DC Current: 300mA; Min Operating Temperature: -55°C; Height - Seated (Max): 0.022inch; Radiation Hardening: No; Inductance: 8.2nH; Packaging: Tape and Reel; REACH SVHC: No SVHC; Case Code (Imperial): 0402; Package Quantity: 1; Tolerance: 5%; Case Code (Metric): 1005; Mount: Surface Mount; Inductance Tolerance: 5%
T520 T522 = TC1-1-13MA+: as T751 on sheet rf_transmit; Datasheet Link: https://www.minicircuits.com/pdfs/TC1-1-13MA+.pdf; Height: 4.06mm; Manufacturer_Part_Number: TC1-1-13MA+; Mouser Part Number: 139-TC1-1-13MA; Mouser Price/Stock: https://www.mouser.co.uk/ProductDetail/Mini-Circuits/TC1-1-13MA%2b?qs=xZ%2FP%252Ba9zWqaQyucfPXsKqA%3D%3D
T521 = CMP-199822-000001-1: as T750 on sheet rf_transmit; Lead Free: Yes; Device Class L3: unset; Temperature: -40°C to +85°C; Manufacturer Part Number: TCM1-63AX+; Frequency: 10-6000MHz; Device Class L2: Transformers; RoHS: TRUE; Octopart: https://octopart.com/tcm1-63ax%2B-mini-circuits-107315723; Temperature Range Low: -40°C; Category: Trans; Package: 0; ComponentLink2URL: https://www.minicircuits.com/pdfs/TCM1-63AX+.pdf; ComponentLink2Description: Datasheet; Automotive: No; Height: 4.06mm; Device Class L1: Passive Components; Temperature Range High: +85°C; Turns Ratio: 1:1